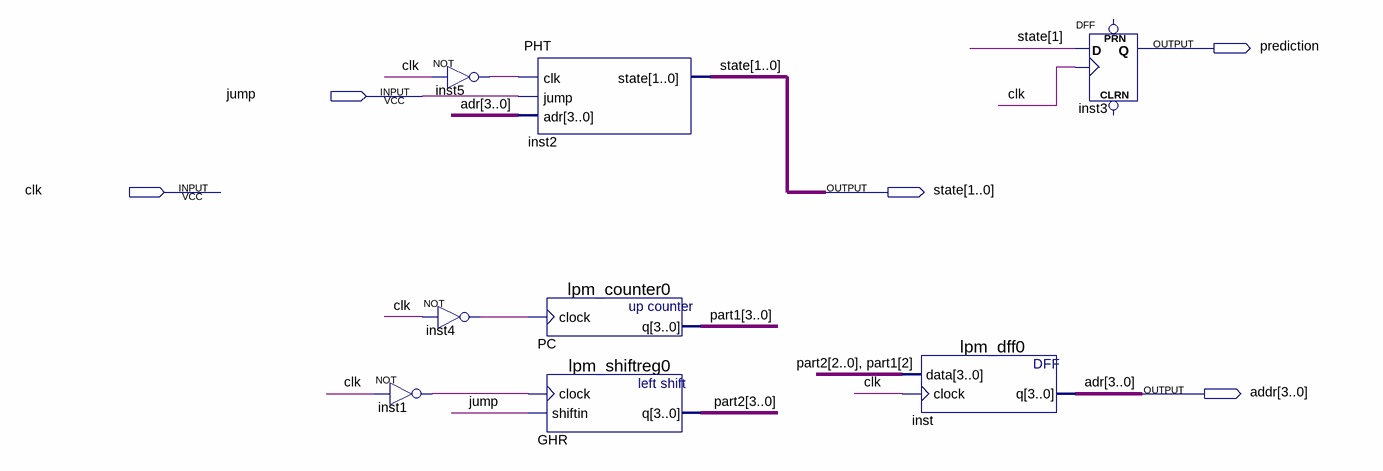
[diagram p0: schematic sheet]
// Quartus schematic lab8.bdf as structural Verilog: 8 symbols, 5 pins
module lab8 (
  input  jump,
  input  clk,
  output prediction,
  output [1:0] state,
  output [3:0] addr
);

  wire inst1_out, inst4_out, inst5_out;
  wire [3:0] part1, part2;

  not inst1 (inst1_out, clk);
  not inst5 (inst5_out, clk);
  not inst4 (inst4_out, clk);
  PHT inst2 (.clk(inst5_out), .jump(jump), .adr(addr), .state(state));
  lpm_counter0 PC (.clock(inst4_out), .q(part1));
  lpm_shiftreg0 GHR (.clock(inst1_out), .shiftin(jump), .q(part2));
  lpm_dff0 inst (.data({part2[2:0], part1[2]}), .clock(clk), .q(addr));
  DFF inst3 (.CLK(clk), .D(state[1]), .Q(prediction));  // open: CLRN, PRN

  // Other names for the same wires on the sheet: adr[3:0] = addr
endmodule
